# EasyEDA Pro project ADA4530_2025-03-15.epro, schematic Schematic1
Board Name: ADC; Create Date: 2024-12-08; Page Name: P1; Project Name: yuhuiceshi; Schematic Name: Schematic1; Update Date: 2025-02-16; Company: 嘉立创EDA; Page Size: A4; Version: V1.0
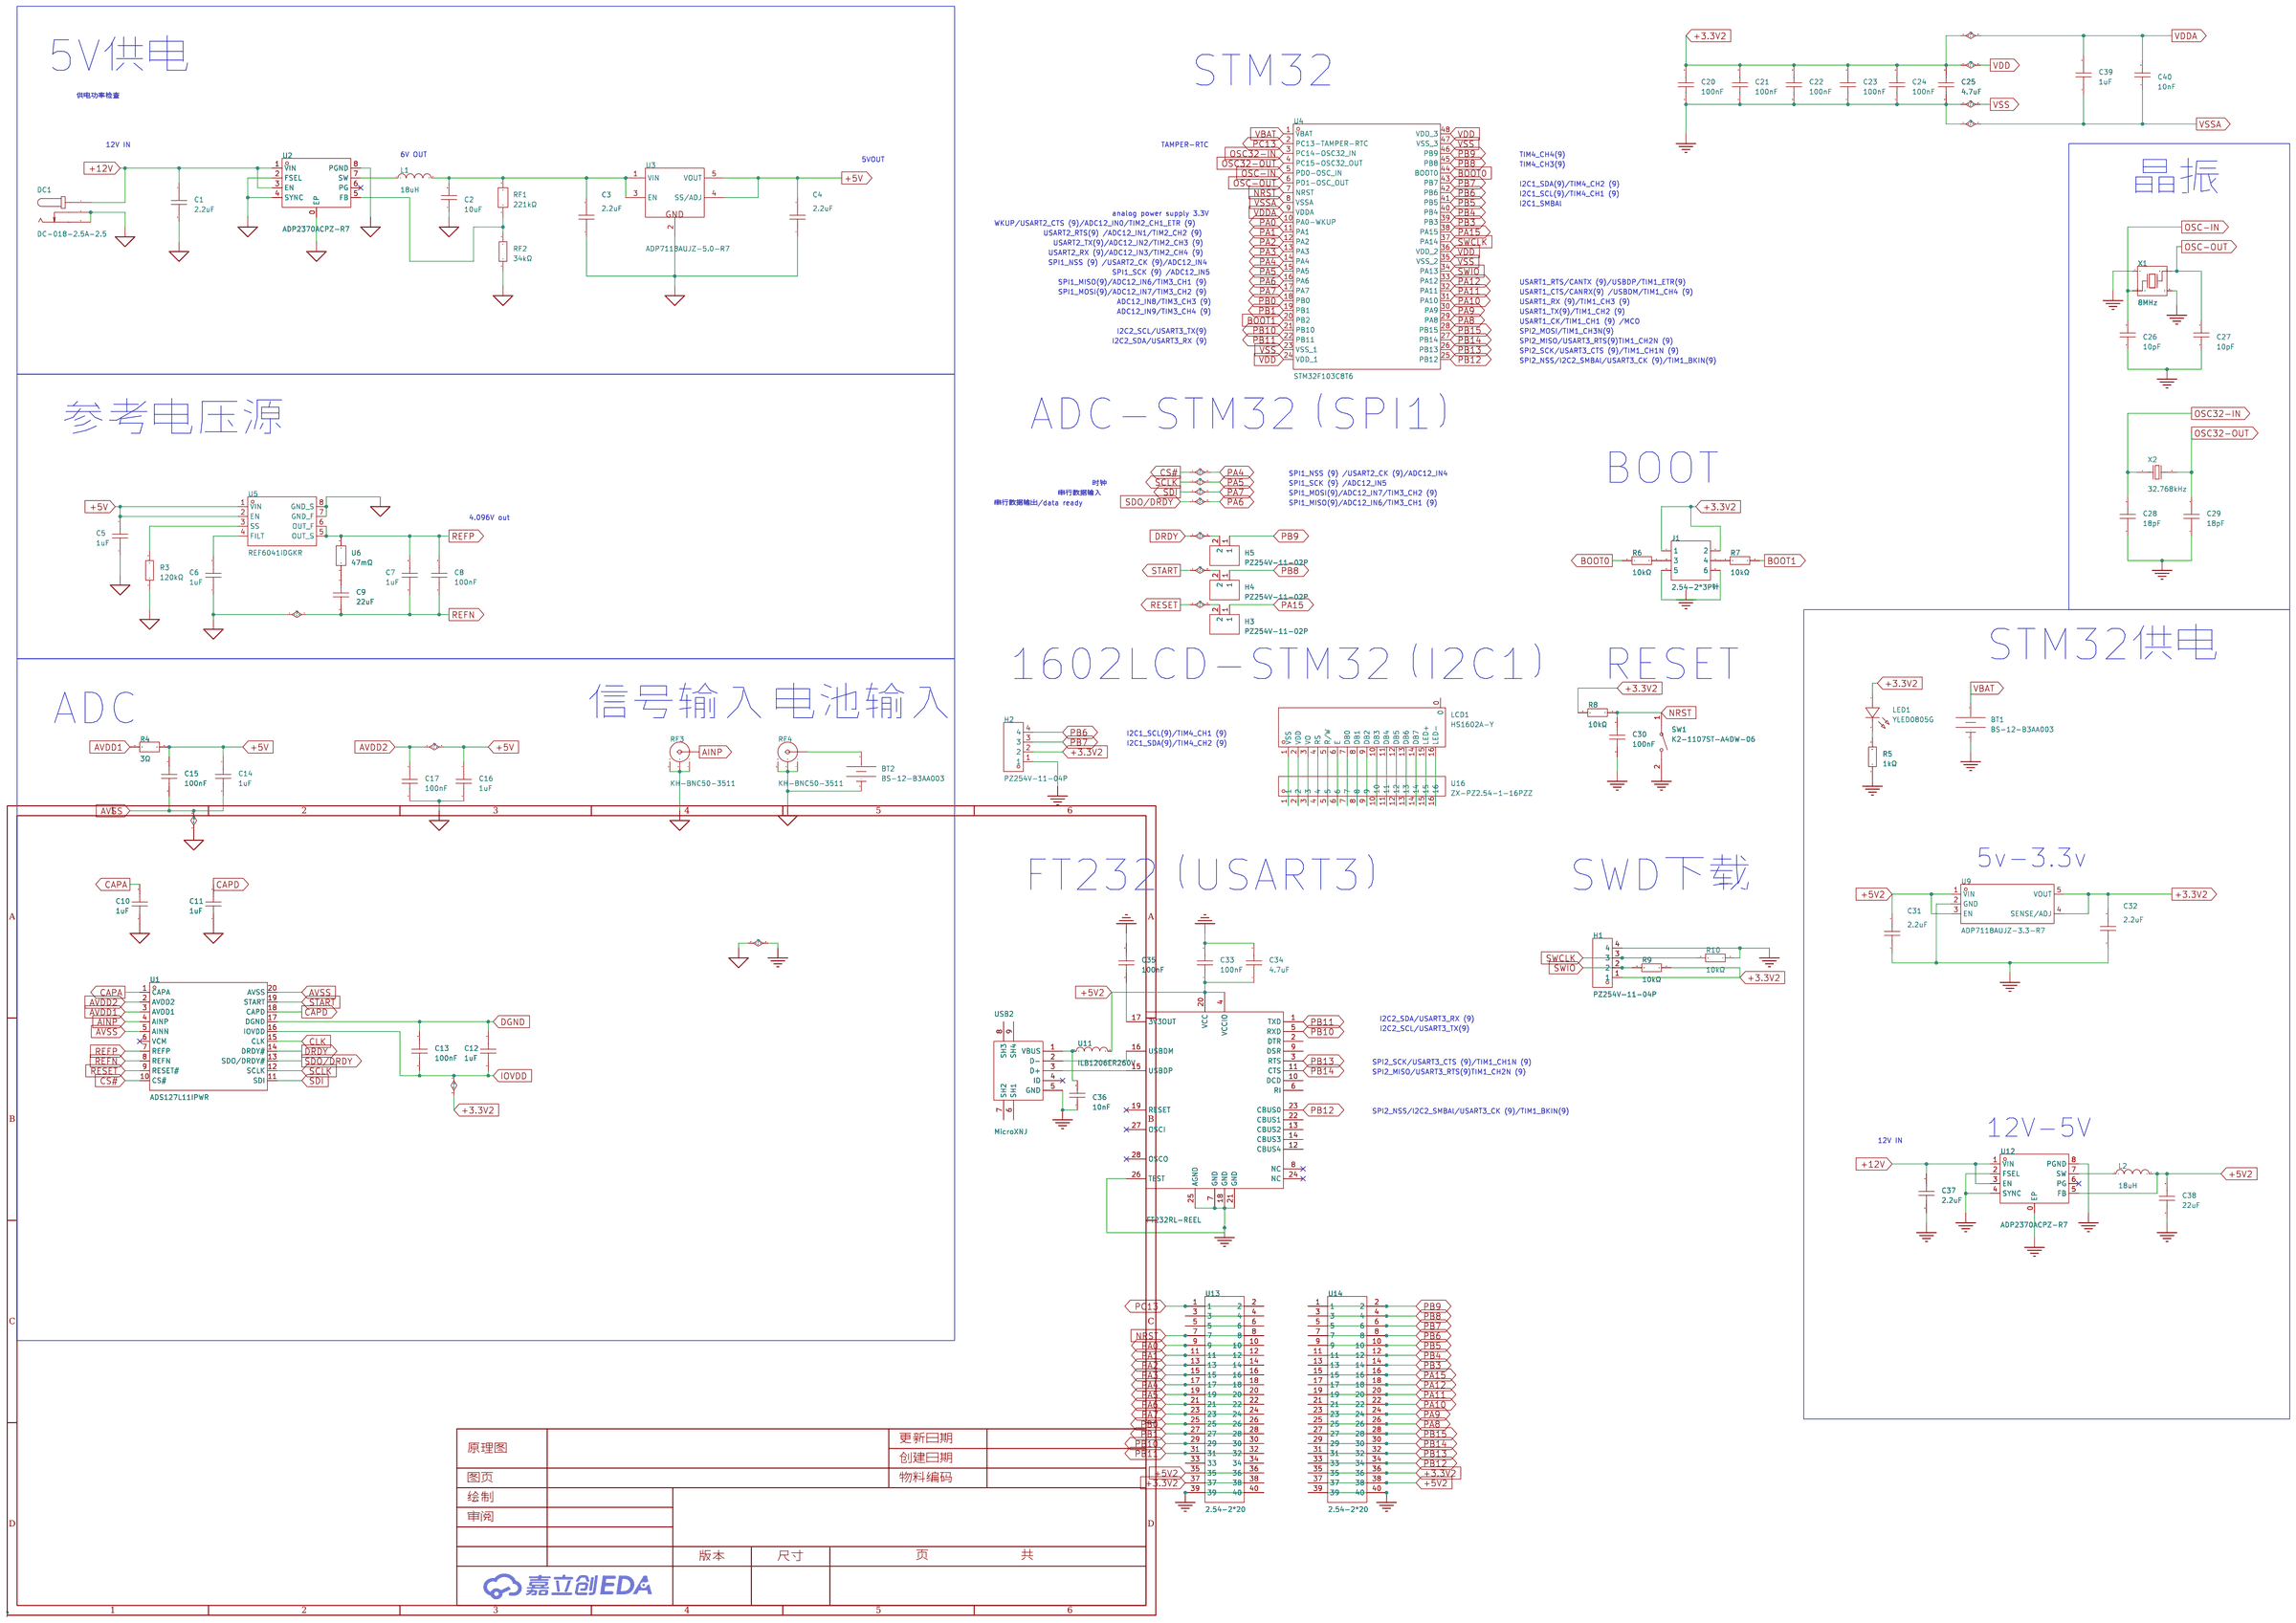
[diagram p2: schematic sheet]

## Parts
BT1  BS-12-B3AA003  [BAT-SMD_BS-12-B3AA011]
BT2  BS-12-B3AA003  [BAT-SMD_BS-12-B3AA011]
C1  2.2uF  [C0805]
C2  10uF  [C1206]
C3  2.2uF  [C0805]
C4  2.2uF  [C0805]
C5  1uF  [C0603]
C6  1uF  [C0603]
C7  1uF  [C0603]
C8  100nF  [C0402]
C9  22uF  [C1210]
C10  1uF  [C0603]
C11  1uF  [C0603]
C12  1uF  [C0603]
C13  100nF  [C0402]
C14  1uF  [C0603]
C15  100nF  [C0402]
C16  1uF  [C0603]
C17  100nF  [C0402]
C20  100nF  [C0402]
C21  100nF  [C0402]
C22  100nF  [C0402]
C23  100nF  [C0402]
C24  100nF  [C0402]
C25  4.7uF  [C0402]
C26  10pF  [C0603]
C27  10pF  [C0603]
C28  18pF  [C0603]
C29  18pF  [C0603]
C30  100nF  [C0402]
C31  2.2uF  [C0805]
C32  2.2uF  [C0805]
C33  100nF  [C0402]
C34  4.7uF  [C0402]
C35  100nF  [C0402]
C36  10nF  [C0603]
C37  2.2uF  [C0805]
C38  22uF  [C0603]
C39  1uF  [C0603]
C40  10nF  [C0603]
DC1  DC-018-2.5A-2.5  [DC-IN-TH_DC-018]
H1  PZ254V-11-04P  [HDR-TH_4P-P2.54-V-M]
H2  PZ254V-11-04P  [HDR-TH_4P-P2.54-V-M]
H3  PZ254V-11-02P  [HDR-TH_2P-P2.54-V-M]
H4  PZ254V-11-02P  [HDR-TH_2P-P2.54-V-M]
H5  PZ254V-11-02P  [HDR-TH_2P-P2.54-V-M]
J1  2.54-2*3P针  [HDR-TH_6P-P2.54-V-M-R2-C3-S2.54-1]
L1  18uH  [IND-SMD_L12.7-W12.7]
L2  18uH  [IND-SMD_L12.7-W12.7]
LCD1  HS1602A-Y  [LCD1602]
LED1  YLED0805G  [LED0805-FD]
R3  120kΩ  [R0603]
R4  3Ω  [R0402]
R5  1kΩ  [R0805]
R6  10kΩ  [R0805]
R7  10kΩ  [R0805]
R8  10kΩ  [R0805]
R9  10kΩ  [R0805]
R10  10kΩ  [R0805]
RF1  221kΩ  [R0603]
RF2  34kΩ  [R0603]
RF3  KH-BNC50-3511  [ANT-TH_KH-BNC50-3511]
RF4  KH-BNC50-3511  [ANT-TH_KH-BNC50-3511]
SW1  K2-1107ST-A4DW-06  [KEY-SMD_L6.2-W3.6-LS8.0]
U1  ADS127L11IPWR  [TSSOP-20_L6.5-W4.4-P0.65-LS6.4-BL]
U2  ADP2370ACPZ-R7  [LFCSP-8_L3.0-W3.0-P0.50-BL-EP_ADP2370ACPZ-R7]
U3  ADP7118AUJZ-5.0-R7  [SOT-23-5_L3.0-W1.7-P0.95-LS2.8-BR]
U4  STM32F103C8T6  [LQFP-48_L7.0-W7.0-P0.50-LS9.0-BL]
U5  REF6041IDGKR  [VSSOP-8_L3.0-W3.0-P0.65-LS4.9-BL]
U6  47mΩ  [R1210]
U9  ADP7118AUJZ-3.3-R7  [TSOT-23-5_L2.9-W1.6-P0.95-LS2.8-BR]
U10  FT232RL-REEL  [SSOP-28_L10.2-W5.3-P0.65-LS7.8-BL]
U11  ILB1206ER260V  [L1206]
U12  ADP2370ACPZ-R7  [LFCSP-8_L3.0-W3.0-P0.50-BL-EP_ADP2370ACPZ-R7]
U13  2.54-2*20  [HDR-TH_40P-P2.54-V-F-R2-C20-S2.54]
U14  2.54-2*20  [HDR-TH_40P-P2.54-V-F-R2-C20-S2.54]
U16  ZX-PZ2.54-1-16PZZ  [HDR-TH_16P-P2.54-V-M-2]
USB2  MicroXNJ  [MICRO-USB-SMD_MICROXNJ]
X1  8MHz  [CRYSTAL-SMD_4P-L3.2-W2.5-BL]
X2  32.768kHz  [FC-135R_L3.2-W1.5]

## Library data of the parts
BT1 BT2 = BS-12-B3AA003: 连接器类型:电池底座;适用电池规格:CR1220;触头材质:磷青铜;工作温度范围:-25℃~+85℃;; LCSC Part Name: 电池底座 适用电池:CR1220; Supplier Part: C964723; Manufacturer: MYOUNG(美阳); Supplier Footprint: SMD; JLCPCB Part Class: 扩展库; Datasheet: https://atta.szlcsc.com/upload/public/pdf/source/20201218/C964723_733B638E287393F86295A2A4DAE43C75.pdf; Supplier: LCSC; Connector Type: 电池底座; Battery Type: CR1220; Contact Material: 磷青铜; Operating Temperature Range: -25℃~+85℃
C1 C3 C4 C31 C32 C37 = CL21A225KBQNNNE: 容值:2.2uF;精度:±10%;额定电压:50V;材质(温度系数):X5R;; LCSC Part Name: 2.2uF ±10% 50V; Supplier Part: C377773; Manufacturer: SAMSUNG(三星); Supplier Footprint: 0805; JLCPCB Part Class: 基础库; Datasheet: https://atta.szlcsc.com/upload/public/pdf/source/20160218/1457707763339.pdf; Supplier: LCSC; Tolerance: ±10%; Voltage Rated: 50V; Temperature Coefficient: X5R
C2 = CL31A106KAHNNNE: 容值:10uF;精度:±10%;额定电压:25V;材质(温度系数):X5R;; LCSC Part Name: 10uF ±10% 25V; Supplier Part: C9807; Manufacturer: SAMSUNG(三星); Supplier Footprint: 1206; JLCPCB Part Class: 扩展库; Datasheet: https://atta.szlcsc.com/upload/public/pdf/source/20160218/1457707763339.pdf; Supplier: LCSC; Tolerance: ±10%; Voltage Rated: 25V; Temperature Coefficient: X5R
C5-C7 C10-C12 C14 C16 C39 = CL10A105KB8NNNC: 容值:1uF;精度:±10%;额定电压:50V;材质(温度系数):X5R;; LCSC Part Name: 1uF ±10% 50V; Supplier Part: C15849; Manufacturer: SAMSUNG(三星); Supplier Footprint: 0603; JLCPCB Part Class: 基础库; Datasheet: https://atta.szlcsc.com/upload/public/pdf/source/20160218/1457707763339.pdf; Supplier: LCSC; Tolerance: ±10%; Voltage Rated: 50V; Temperature Coefficient: X5R
C8 C13 C15 C17 C20-C24 C30 C33 C35 = GRM155R71A104KA01D: 容值:100nF;精度:±10%;额定电压:10V;材质(温度系数):X7R;; LCSC Part Name: 100nF ±10% 10V; Supplier Part: C71687; Manufacturer: muRata(村田); Supplier Footprint: 0402; JLCPCB Part Class: 扩展库; Datasheet: https://atta.szlcsc.com/upload/public/pdf/source/20180228/C71687_15198055953951377607.pdf; Supplier: LCSC; Tolerance: ±10%; Voltage Rated: 10V; Temperature Coefficient: X7R
C9 = CL32B226KAJNNNE: 容值:22uF;精度:±10%;额定电压:25V;材质(温度系数):X7R;; LCSC Part Name: 22uF ±10% 25V; Supplier Part: C309062; Manufacturer: SAMSUNG(三星); Supplier Footprint: 1210; JLCPCB Part Class: 扩展库; Datasheet: https://atta.szlcsc.com/upload/public/pdf/source/20160218/1457707763339.pdf; Supplier: LCSC; Tolerance: ±10%; Voltage Rated: 25V; Temperature Coefficient: X7R
C25 C34 = CL05A475KP5NRNC: 容值:4.7uF;精度:±10%;额定电压:10V;材质(温度系数):X5R;; LCSC Part Name: 4.7uF ±10% 10V; Supplier Part: C368809; Manufacturer: SAMSUNG(三星); Supplier Footprint: 0402; JLCPCB Part Class: 扩展库; Datasheet: https://atta.szlcsc.com/upload/public/pdf/source/20160218/1457707763339.pdf; Supplier: LCSC; Tolerance: ±10%; Voltage Rated: 10V; Temperature Coefficient: X5R
C26 C27 = CL10C100JB8NNNC: 容值:10pF;精度:±5%;额定电压:50V;材质(温度系数):C0G;; LCSC Part Name: 10pF ±5% 50V; Supplier Part: C1634; Manufacturer: SAMSUNG(三星); Supplier Footprint: 0603; JLCPCB Part Class: 基础库; Datasheet: https://atta.szlcsc.com/upload/public/pdf/source/20160218/1457707763339.pdf; Supplier: LCSC; Tolerance: ±5%; Voltage Rated: 50V; Temperature Coefficient: C0G
C28 C29 = FCC0603N180J500CT: 容值:18pF;精度:±5%;额定电压:50V;材质(温度系数):C0G;; LCSC Part Name: 18pF ±5% 50V; Supplier Part: C5137620; Manufacturer: FOJAN(富捷); Supplier Footprint: 0603; JLCPCB Part Class: 扩展库; Datasheet: https://atta.szlcsc.com/upload/public/pdf/source/20220818/0EB3B7FB2F5648AC16609637FBA7DABE.pdf; Supplier: LCSC; Tolerance: ±5%; Voltage Rated: 50V; Temperature Coefficient: C0G
C36 C40 = CC0603KRX7R9BB103: 容值:10nF;精度:±10%;额定电压:50V;材质(温度系数):X7R;; LCSC Part Name: 10nF ±10% 50V; Supplier Part: C100042; Manufacturer: YAGEO(国巨); Supplier Footprint: 0603; JLCPCB Part Class: 扩展库; Datasheet: https://atta.szlcsc.com/upload/public/pdf/source/20181008/C309510_22F155564471FAF6A489F7D68F34234E.pdf; Supplier: LCSC; Tolerance: ±10%; Voltage Rated: 50V; Temperature Coefficient: X7R
C38 = GRM188R60J226MEA0D: 容值:22uF;精度:±20%;额定电压:6.3V;材质(温度系数):X5R;; LCSC Part Name: 22uF ±20% 6.3V; Supplier Part: C77042; Manufacturer: muRata(村田); Supplier Footprint: 0603; JLCPCB Part Class: 扩展库; Datasheet: https://atta.szlcsc.com/upload/public/pdf/source/20200305/C490387_23319AE8C154DEB24C505E6C82A8106A.pdf; Supplier: LCSC; Tolerance: ±20%; Voltage Rated: 6.3V; Temperature Coefficient: X5R
DC1 = DC-018-2.5A-2.5: 连接器类型:DC电源插座;安装方式:直插;触点内径:2.5mm;触点外径:5.5mm;额定电流:2.5A;额定电压:24V;工作温度范围:-20℃~+70℃;; LCSC Part Name: DC电源插座 内径:2.5mm 外径:5.5mm; Supplier Part: C2880553; Manufacturer: XKB Connection(中国星坤); Supplier Footprint: 插件; JLCPCB Part Class: 扩展库; Datasheet: https://atta.szlcsc.com/upload/public/pdf/source/20211011/841513E81FE39239E013AD10F679532A.pdf; Supplier: LCSC; Connector Type: DC电源插座; Mounting Style: 直插; Inside Contact Diameter: 2.5mm; Outside Contact Diameter: 5.5mm; Current Rating (Max): 2.5A; Voltage Rating (Max): 24V; Operating Temperature Range: -20℃~+70℃
H1 H2 = PZ254V-11-04P: 插针结构:1x4P;间距:2.54mm;行距:-;圆针/方针:方针;安装类型:直插;排数:单排;总PIN位数:4P;额定电流:3A;额定电压:250V;配合针长度:6mm;塑高:2.5mm;端接针长度:3mm;触头材质:-;工作温度范围:-40℃~+105℃;颜色:黑色;; LCSC Part Name: 间距:2.54mm 1x4P 直插 方针; Supplier Part: C2691448; Manufacturer: XFCN(兴飞); Supplier Footprint: 插件,P=2.54mm; JLCPCB Part Class: 扩展库; Datasheet: https://atta.szlcsc.com/upload/public/pdf/source/20200309/C492403_F9F19131791D08044AD4F84F8E751A34.pdf; Supplier: LCSC; Pin Structure: 1x4P; Pitch: 2.54mm; Circluar Pins/Square Pins: 方针; Mounting Type: 直插; Number of Rows: 单排; Number of Pins: 4P; Current Rating (Max): 3A; Voltage Rating (Max): 250V; Length of Mating Pin: 6mm; Insulation Height: 2.5mm; Length of End Connection Pin: 3mm; Operating Temperature Range: -40℃~+105℃; Color: 黑色
H3-H5 = PZ254V-11-02P: 插针结构:1x2P;间距:2.54mm;行距:-;圆针/方针:方针;安装类型:直插;排数:单排;总PIN位数:2P;额定电流:-;额定电压:-;配合针长度:6mm;塑高:2.5mm;端接针长度:3mm;触头材质:黄铜;触头镀层:-;工作温度范围:-40℃~+105℃;颜色:黑色;; LCSC Part Name: 间距:2.54mm 1x2P 直插 方针; Supplier Part: C492401; Manufacturer: XFCN(兴飞); Supplier Footprint: 插件,P=2.54mm; JLCPCB Part Class: 扩展库; Datasheet: https://atta.szlcsc.com/upload/public/pdf/source/20200309/C492401_A812433581A9B211A7FFA413ADDFF0E5.pdf; Supplier: LCSC; Pin Structure: 1x2P; Pitch: 2.54mm; Circluar Pins/Square Pins: 方针; Mounting Type: 直插; Number of Rows: 单排; Number of Pins: 2P; Length of Mating Pin: 6mm; Insulation Height: 2.5mm; Length of End Connection Pin: 3mm; Contact Material: 黄铜; Operating Temperature Range: -40℃~+105℃; Color: 黑色
J1 = 2.54-2*3P针: 插针结构:-;间距:2.54mm;行距:-;圆针/方针:-;安装类型:直插;排数:双排;总PIN位数:6P;额定电流:-;额定电压:-;配合针长度:-;塑高:-;触头材质:-;触头镀层:-;颜色:黑色;; LCSC Part Name: 间距:2.54mm 直插; Supplier Part: C65114; Manufacturer: BOOMELE(博穆精密); Supplier Footprint: 插件,P=2.54mm; JLCPCB Part Class: 扩展库; Supplier: LCSC; Pitch: 2.54mm; Mounting Type: 直插; Number of Rows: 双排; Number of Pins: 6P; Color: 黑色
L1 L2 = SRR1208-180ML: 电感值:18uH;精度:±20%;额定电流:3.8A;饱和电流(Isat):4A;类型:-;; LCSC Part Name: 18uH ±20% 4A; Supplier Part: C1331002; Manufacturer: BOURNS; Supplier Footprint: SMD,12.7x12.7mm; JLCPCB Part Class: 扩展库; Datasheet: https://atta.szlcsc.com/upload/public/pdf/source/20210611/27EB3296191C192B2696E5AAF504BCA4.pdf; Supplier: LCSC; Tolerance: ±20%; Rated Current: 3.8A; Saturation Current (Isat): 4A; DC Resistance (DCR): 40mΩ
LCD1 = HS1602A-Y: 主控芯片:SPLC780;尺寸(inch):2;; LCSC Part Name: 2寸16x2字符型8位通讯单色LCD液晶显示模组黄绿屏; Supplier Part: C18198250; Manufacturer: HS(汉昇); JLCPCB Part Class: 扩展库; Datasheet: https://atta.szlcsc.com/upload/public/pdf/source/20230921/41ABF4C08C578F5401713169C9FD3309.pdf; Supplier: LCSC; Main Control Chip: SPLC780; Size: 2; Operating Temperature: -20℃~+70℃
LED1 = YLED0805G: 翠绿; LCSC Part Name: 发光管; Supplier Part: C25170728; Manufacturer: YONGYUTAI(永裕泰); Supplier Footprint: 0805; JLCPCB Part Class: 扩展库; Datasheet: https://atta.szlcsc.com/upload/public/pdf/source/20240703/FE33100110A935C7236A3399DDEE41BC.pdf; Supplier: LCSC
R3 = 0603WAF1203T5E: 电阻类型:厚膜电阻;阻值:120kΩ;精度:±1%;功率:100mW;最大工作电压:75V;温度系数:±100ppm/℃;; LCSC Part Name: 120kΩ ±1% 100mW 厚膜电阻; Supplier Part: C25808; Manufacturer: UNI-ROYAL(厚声); Supplier Footprint: 0603; JLCPCB Part Class: 基础库; Datasheet: https://atta.szlcsc.com/upload/public/pdf/source/20200306/C422600_1E6D84923E4A46A82E41ADD87F860B5C.pdf; Supplier: LCSC; Type: 厚膜电阻; Tolerance: ±1%; Power(Watts): 100mW; Overload Voltage (Max): 75V; Temperature Coefficient: ±100ppm/℃; Operating Temperature Range: -55℃~+155℃
R4 = FRC0402F3R00TS: 电阻类型:厚膜电阻;阻值:3Ω;精度:±1%;功率:62.5mW;最大工作电压:50V;温度系数:±200ppm/℃;; LCSC Part Name: 3Ω ±1% 62.5mW 厚膜电阻; Supplier Part: C2933093; Manufacturer: FOJAN(富捷); Supplier Footprint: 0402; JLCPCB Part Class: 扩展库; Datasheet: https://atta.szlcsc.com/upload/public/pdf/source/20211221/925EC7D7225764EE0046F22065062C87.pdf; Supplier: LCSC; Type: 厚膜电阻; Tolerance: ±1%; Power(Watts): 62.5mW; Overload Voltage (Max): 50V; Temperature Coefficient: ±200ppm/℃; Operating Temperature Range: -55℃~+155℃
R5 = AR05BTDW1001: 电阻类型:薄膜电阻;阻值:1kΩ;精度:±0.1%;功率:125mW;最大工作电压:100V;温度系数:±50ppm/℃;; LCSC Part Name: 薄膜电阻 1kΩ ±0.1% 125mW; Supplier Part: C319815; Manufacturer: Viking(光颉); Supplier Footprint: 0805; JLCPCB Part Class: Extended Part; Datasheet: https://atta.szlcsc.com/upload/public/pdf/source/20191129/C465721_10D49275DB41E427863CE9C8D788770A.pdf; Supplier: LCSC; Type: 薄膜电阻; Tolerance: ±0.1%; Power(Watts): 125mW; Overload Voltage (Max): 100V; Temperature Coefficient: ±50ppm/℃; Operating Temperature Range: -55℃~+155℃
R6-R10 = 0805W8F1002T5E_C17414: 电阻类型:厚膜电阻;阻值:10kΩ;精度:±1%;功率:125mW;最大工作电压:150V;温度系数:±100ppm/℃;; LCSC Part Name: 10kΩ ±1% 125mW 厚膜电阻; Supplier Part: C17414; Manufacturer: UNI-ROYAL(厚声); Manufacturer Part: 0805W8F1002T5E; Supplier Footprint: 0805; JLCPCB Part Class: 基础库; Datasheet: https://atta.szlcsc.com/upload/public/pdf/source/20200306/C422600_1E6D84923E4A46A82E41ADD87F860B5C.pdf; Supplier: LCSC; Type: 厚膜电阻; Tolerance: ±1%; Power(Watts): 125mW; Overload Voltage (Max): 150V; Temperature Coefficient: ±100ppm/℃; Operating Temperature Range: -55℃~+155℃
RF1 = FRC0603F2213TS: 电阻类型:厚膜电阻;阻值:221kΩ;精度:±1%;功率:100mW;温度系数:±100ppm/℃;; LCSC Part Name: 厚膜电阻 221kΩ ±1% 100mW; Supplier Part: C7467463; Manufacturer: FOJAN(富捷); Supplier Footprint: 0603; JLCPCB Part Class: 扩展库; Datasheet: https://atta.szlcsc.com/upload/public/pdf/source/20211221/9022FBEBBD509006A57EBC43C1F2F40C.pdf; Supplier: LCSC; Type: 厚膜电阻; Tolerance: ±1%; Power(Watts): 100mW; Temperature Coefficient: ±100ppm/℃
RF2 = 0603WAF3402T5E: 电阻类型:厚膜电阻;阻值:34kΩ;精度:±1%;功率:100mW;最大工作电压:75V;温度系数:±100ppm/℃;; LCSC Part Name: 34kΩ ±1% 100mW 厚膜电阻; Supplier Part: C23008; Manufacturer: UNI-ROYAL(厚声); Supplier Footprint: 0603; JLCPCB Part Class: 扩展库; Datasheet: https://atta.szlcsc.com/upload/public/pdf/source/20200306/C422600_1E6D84923E4A46A82E41ADD87F860B5C.pdf; Supplier: LCSC; Type: 厚膜电阻; Tolerance: ±1%; Power(Watts): 100mW; Overload Voltage (Max): 75V; Temperature Coefficient: ±100ppm/℃; Operating Temperature Range: -55℃~+155℃
RF3 RF4 = KH-BNC50-3511: 连接器类型:板端;接口类型:内孔;端口数量:1;接口直径:9.5mm;接口长度/高度:-;频率-最大值:3GHz;射频系列:BNC;阻抗:50Ω;样式:弯头;工作温度范围:-55℃~+155℃;; LCSC Part Name: BNC 内孔 弯头; Supplier Part: C2837587; Manufacturer: kinghelm(金航标); Supplier Footprint: 插件; JLCPCB Part Class: 扩展库; Datasheet: https://atta.szlcsc.com/upload/public/pdf/source/20221123/AFF24A942BB0EF6B7776F494013BE75C.pdf; Supplier: LCSC; Connector Type: 板端; Interface Type: 内孔; Number of Ports: 1; Interface Diameter: 9.5mm; Frequency-Max: 3GHz; RF Series: BNC; Impedance: 50Ω; Style: 弯头; Operating Temperature Range: -55℃~+155℃
SW1 = K2-1107ST-A4DW-06: 电路结构:单刀单掷;按钮形状:矩形按钮;作用力:250gf;安装方式:立贴;开关长度:6.1mm;开关宽度:3.6mm;开关高度:2.5mm;触点电流:50mA;额定电压(DC):12V;绝缘电阻:100MΩ;带灯:-;机械寿命:10万次;; LCSC Part Name: 轻触开关 3.6*6.1*2.5; Supplier Part: C118141; Manufacturer: 韩国韩荣; Supplier Footprint: SMD; JLCPCB Part Class: 扩展库; Datasheet: https://atta.szlcsc.com/upload/public/pdf/source/20210810/381712CEF248770C072B585C3485C888.pdf; Supplier: LCSC; Circuit: 单刀单掷; Actuator Style: 矩形按钮; Operating Force: 250gf; Mounting Style: 立贴; Switch Length: 6.1mm; Switch Width: 3.6mm; Switch Height: 2.5mm; Contact Current: 50mA; Voltage Rating (DC): 12V; Insulation Resistance: 100MΩ; Mechanical Life: 10万次; Operating Temperature: -25℃~+85℃
U1 = ADS127L11IPWR: 接口:串行；SPI;电源电压:2.85V~5.5V;采样率:400kHz;分辨率:24;; LCSC Part Name: 具有易驱动输入和宽带或低延迟滤波器的 24 位 400kSPS ADC; Supplier Part: C5215155; Manufacturer: TI(德州仪器); Supplier Footprint: TSSOP-20-175mil; JLCPCB Part Class: 扩展库; Datasheet: https://www.ti.com/cn/lit/gpn/ads127l11; Supplier: LCSC; Interface: 串行；SPI; differential input: 是; number of channels: 1; Supply Voltage: 2.85V~5.5V; sampling frequency: 400kHz; resolution: 24; Operating Temperature: -45℃~+125℃
U2 U12 = ADP2370ACPZ-R7: 功能类型:降压型;输出类型:可调;工作电压:3.2V~15V;输出电压:-;输出电流:800mA;; LCSC Part Name: 800mA、低静态电流降压调节器; Supplier Part: C481882; Manufacturer: ADI(亚德诺); Supplier Footprint: LFCSP-8-WD(3x3); JLCPCB Part Class: 扩展库; Datasheet: https://atta.szlcsc.com/upload/public/pdf/source/20200113/C481882_3242BD049A7F7733653B76B10E6A9D8D.pdf; Supplier: LCSC; Function: 降压型; Output Type: 可调; Input Voltage: 3.2V~15V; Output Current: 800mA; Operating Temperature: -40℃~+125℃; Number of Outputs: 1; Topology: 降压式; Switch tube (built-in/external): 内置
U3 = ADP7118AUJZ-5.0-R7: 输出类型:固定;最大输入电压:20V;输出电压:5V;最大输出电流:200mA;输出极性:正极;; Supplier Part: C141943; Manufacturer: ADI(亚德诺); Supplier Footprint: TSOT-23-5; JLCPCB Part Class: 扩展库; Datasheet: https://atta.szlcsc.com/upload/public/pdf/source/20180628/C194022_239F12D87A493F0A2DF0E3CFBC8CAC3D.pdf; Supplier: LCSC; Output Type: 固定; Maximum Input Voltage: 20V; Output Voltage: 5V; MAX Output Current: 200mA; Dropout Voltage: 420mV@(200mA); standby current: 140uA; Operating Temperature: -40℃~+125℃@(Ta); Output Polarity: 正极; Number of Outputs: 1
U4 = STM32F103C8T6: CPU内核:ARM-M3;CPU最大主频:72MHz;应用领域:-;; LCSC Part Name: 主流增强型ARM Cortex-M3 MCU，具有64 KB Flash、72 MHz CPU、电机控制、USB和CAN; Supplier Part: C8734; Manufacturer: ST(意法半导体); Supplier Footprint: LQFP-48(7x7); JLCPCB Part Class: 扩展库; Datasheet: https://atta.szlcsc.com/upload/public/pdf/source/20220812/8363ACEC51AD55ECEB84799464F7CB85.pdf; Supplier: LCSC; CPU Core: ARM-M3; CPU Maximum Speed: 72MHz; Program Storage Size: 64KB; Program Memory Type: FLASH; Number of I/O: 37; ADC (Bit): 12bit; Low Voltage Detection Threshold: 2V~3.6V
U5 = REF6041IDGKR: 输出类型:固定;输入电压:4.35V~5.5V;输出电流:4mA;精度:±0.05%;; Supplier Part: C2157051; Manufacturer: TI(德州仪器); Supplier Footprint: VSSOP-8-0.65mm; JLCPCB Part Class: 扩展库; Datasheet: https://www.ti.com/cn/lit/gpn/ref6033; Supplier: LCSC; Output Type: 固定; Input Voltage: 4.35V~5.5V; Output Current: 4mA; Tolerance: ±0.05%; Temperature Coefficient: 5ppm/℃; Reference Type: 串联; Supply Current: 1.1mA; Noise - 1/10Hz to 10Hz: 3uVp-p; Operating Temperature: -40℃~+125℃@(Ta)
U6 = RL1210FR-070R047L: 电阻类型:厚膜电阻;阻值:47mΩ;精度:±1%;功率:500mW;温度系数:±1000ppm/℃;; LCSC Part Name: 厚膜电阻 47mΩ ±1% 500mW; Supplier Part: C728531; Manufacturer: YAGEO(国巨); Supplier Footprint: 1210; JLCPCB Part Class: 扩展库; Datasheet: https://atta.szlcsc.com/upload/public/pdf/source/20200831/C728531_EE5B3688874933D6C39DA60DA0663108.pdf; Supplier: LCSC; Type: 厚膜电阻; Tolerance: ±1%; Power(Watts): 500mW; Temperature Coefficient: ±1000ppm/℃; Operating Temperature Range: -55℃~+155℃
U9 = ADP7118AUJZ-3.3-R7: 输出类型:固定;最大输入电压:20V;输出电压:3.3V;最大输出电流:200mA;电源纹波抑制比(PSRR):88dB;输出极性:正极;; LCSC Part Name: 输入20V 输出3.3V 200mA; Supplier Part: C194022; Manufacturer: ADI(亚德诺); Supplier Footprint: TSOT-23-5; JLCPCB Part Class: 扩展库; Datasheet: https://atta.szlcsc.com/upload/public/pdf/source/20180628/C194022_239F12D87A493F0A2DF0E3CFBC8CAC3D.pdf; Supplier: LCSC; Output Type: 固定; Maximum Input Voltage: 20V; Output Voltage: 3.3V; MAX Output Current: 200mA; Power Supply Rejection Ratio (PSRR): 88dB; Dropout Voltage: 420mV@(200mA); standby current: 140uA; Operating Temperature: -40℃~+125℃@(Ta); Output Polarity: 正极; Number of Outputs: 1
U10 = FT232RL-REEL: 应用功能:USB转UART;接口协议:-;; LCSC Part Name: FT232R USB UART 芯片; Supplier Part: C8690; Manufacturer: FTDI(飞特帝亚); Supplier Footprint: SSOP-28-208mil; JLCPCB Part Class: 扩展库; Datasheet: https://atta.szlcsc.com/upload/public/pdf/source/20130221/1457706592200.pdf; Supplier: LCSC; Applications Function: USB转UART; Supply Voltage: 3.3V~5.25V; Operating Temperature: -40℃~+85℃
U11 = ILB1206ER260V: 标称阻抗@测试频率:26Ω@100MHz;直流电阻(RDC):50mΩ;; Supplier Part: C2999377; Manufacturer: VISHAY(威世); Supplier Footprint: 1206; JLCPCB Part Class: 扩展库; Datasheet: https://atta.szlcsc.com/upload/public/pdf/source/20220429/A7FF318AFF1E23934AC6E57BABB68AC1.pdf; Supplier: LCSC; Impedance @ Frequency: 26Ω@100MHz; DC Resistance: 50mΩ; Circuits: 1
U13 U14 = 2.54-2*20: 插孔结构:2x20P;间距:2.54mm;行距:2.54mm;圆孔/方孔:方孔;安装类型:直插;排数:双排;总孔位数:40P;额定电流:2.5A;额定电压:-;插孔方向:顶部;塑高:8.5mm;工作温度范围:-40℃~+105℃;; LCSC Part Name: 间距:2.54mm 2x20P 直插; Supplier Part: C2977589; Manufacturer: ZHOURI(洲日); Supplier Footprint: 插件,P=2.54mm; JLCPCB Part Class: 扩展库; Datasheet: https://atta.szlcsc.com/upload/public/pdf/source/20220328/834E302BE3C038BBC5C70F5E02589B1E.pdf; Supplier: LCSC; Holes Structure: 2x20P; Pitch: 2.54mm; Row Spacing: 2.54mm; Circular Hole / Square Hole: 方孔; Mounting Type: 直插; Number of Rows: 双排; Number of Holes: 40P; Current Rating (Max): 2.5A; Holes Direction: 顶部; Insulation Height: 8.5mm; Operating Temperature Range: -40℃~+105℃
U16 = ZX-PZ2.54-1-16PZZ: 插针结构:1x16P;间距:2.54mm;行距:-;圆针/方针:方针;安装类型:直插;排数:单排;总PIN位数:16P;额定电流:3A;额定电压:1kV;配合针长度:6mm;塑高:2.5mm;端接针长度:3mm;触头材质:黄铜;触头镀层:金;工作温度范围:-40℃~+105℃;焊接温度(最大值):-;颜色:黑色;; LCSC Part Name: 1x16P 间距:2.54mm 方针 直插; Supplier Part: C7501270; Manufacturer: Megastar(兆星); Supplier Footprint: 插件,P=2.54mm; JLCPCB Part Class: 扩展库; Datasheet: https://atta.szlcsc.com/upload/public/pdf/source/20231122/E454B24BEC0C004E7BA34E686CD1994E.pdf; Supplier: LCSC; Pin Structure: 1x16P; Pitch: 2.54mm; Circluar Pins/Square Pins: 方针; Mounting Type: 直插; Number of Rows: 单排; Number of Pins: 16P; Current Rating (Max): 3A; Voltage Rating (Max): 1kV; Length of Mating Pin: 6mm; Insulation Height: 2.5mm; Length of End Connection Pin: 3mm; Contact Material: 黄铜; Contact Plating: 金; Operating Temperature Range: -40℃~+105℃; Color: 黑色
USB2 = MicroXNJ: 连接器类型:Micro-B;标准:USB 2.0;公母:母;安装方式:卧贴;触点数量:5P;端口数量:1;额定电流 - 电源:1.8A;工作温度范围:-20℃~+85℃;; LCSC Part Name: Micro-B 母 卧贴; Supplier Part: C404969; Manufacturer: SHOU HAN(首韩); Supplier Footprint: SMD; JLCPCB Part Class: 扩展库; Datasheet: https://atta.szlcsc.com/upload/public/pdf/source/20220415/2494EDFF499AF6F852F7C820374B6AF3.pdf; Supplier: LCSC; Connector Type: Micro-B; Standard: USB 2.0; Gender: 母; Mounting Style: 卧贴; Number of Contacts: 5P; Number of Ports: 1; Current Rating - Power (Max): 1.8A; Operating Temperature Range: -20℃~+85℃; Rated Voltage (Max): 30V; Connect-Disconnect Life: 5千次; Core Colour: 黑色
X1 = TAXM8M4RDBCCT2T: 晶振类型:贴片晶振;频率:8MHz;常温频差:±10ppm;负载电容:10pF;频率稳定度(全温):±15ppm;; LCSC Part Name: 8MHz ±10ppm 10pF; Supplier Part: C400090; Manufacturer: YJX(雅晶鑫); Supplier Footprint: SMD3225-4P; JLCPCB Part Class: 扩展库; Datasheet: https://atta.szlcsc.com/upload/public/pdf/source/20190626/C400090_CF95B89E745AFE4EF2E392EF8AC009D6.pdf; Supplier: LCSC; Crystal Type: 贴片晶振; Normal temperature Frequency Tolerance: ±10ppm; Load Capacitor: 10pF; Frequency Stability(Full temperature range): ±15ppm; Equivalent Series Resistance (ESR): 250Ω; Operating Temperature: -40℃~+85℃
X2 = Q13FC13500004_C32346: 晶振类型:贴片晶振;频率:32.768kHz;常温频差:±20ppm;负载电容:12.5pF;; LCSC Part Name: 32.768kHz ±20ppm 12.5pF; Supplier Part: C32346; Manufacturer: EPSON(爱普生); Manufacturer Part: Q13FC13500004; Supplier Footprint: SMD3215-2P; JLCPCB Part Class: 基础库; Datasheet: https://atta.szlcsc.com/upload/public/pdf/source/20240418/0E0FF5F0356BA3753F616001439D1416.pdf; Supplier: LCSC; Crystal Type: 贴片晶振; Normal temperature Frequency Tolerance: ±20ppm; Load Capacitor: 12.5pF; Equivalent Series Resistance (ESR): 70kΩ; Operating Temperature: -40℃~+85℃

## Nets
+3.3V2: C12.1 C13.1 C20.2 C21.2 C22.2 C23.2 C24.2 C25.2 C32.2 C39.2 C40.2 H1.1 H2.2 J1.1 J1.2 LED1.1(A) R8.2 R9.1 U1.16(IOVDD) U4.9(VDDA) U4.24(VDD_1) U4.36(VDD_2) U4.48(VDD_3) U9.4(SENSE/ADJ) U9.5(VOUT) U13.37 U13.38 U14.35 U14.36
+5V: C4.2 C5.2 C14.1 C15.1 C16.1 C17.1 R4.2 U1.2(AVDD2) U3.4(SS/ADJ) U3.5(VOUT) U5.1(VIN) U5.2(EN)
+5V2: C31.2 C33.1 C34.1 C38.2 L2.2 U9.1(VIN) U9.3(EN) U10.4(VCCIO) U10.20(VCC) U11.2 U12.5(FB) U13.35 U13.36 U14.37 U14.38
+12V: C1.1 C37.1 DC1.1 U2.1(VIN) U2.3(EN) U12.1(VIN) U12.3(EN)
AGND: BT1.2(-) BT2.2(-) C1.2 C2.1 C3.1 C4.1 C5.1 C6.1 C7.1 C8.1 C9.2 C10.1 C11.1 C14.2 C15.2 C16.2 C17.2 C20.1 C21.1 C22.1 C23.1 C24.1 C25.1 C26.1 C27.1 C28.1 C29.1 C30.1 C31.1 C32.1 C33.2 C34.2 C35.2 C36.1 C37.2 C38.1 C39.1 C40.1 DC1.2 DC1.3 H1.4 H2.1 J1.5 J1.6 R3.1 R5.1 R10.1 RF2.1 RF3.2 RF3.3 RF3.4 RF4.2 RF4.3 RF4.4 SW1.2 U1.5(AINN) U1.8(REFN) U1.20(AVSS) U2.0(EP) U2.2(FSEL) U2.4(SYNC) U2.8(PGND) U3.2(GND) U4.8(VSSA) U4.23(VSS_1) U4.35(VSS_2) U4.47(VSS_3) U5.7(GND_F) U5.8(GND_S) U9.2(GND) U10.7(GND) U10.18(GND) U10.21(GND) U10.25(AGND) U10.26(TEST) U12.0(EP) U12.2(FSEL) U12.4(SYNC) U12.8(PGND) U13.39 U13.40 U14.39 U14.40 USB2.5(GND) X1.2 X1.4
AVDD1: R4.1 U1.3(AVDD1)
DGND: C12.2 C13.2 U1.17(DGND)
VBAT: BT1.1(+) U4.1(VBAT)
AINP: RF3.1(OUT) U1.4(AINP)
BOOT0: R6.1 U4.44(BOOT0)
BOOT1: R7.2 U4.20(PB2)
CAPA: C10.2 U1.1(CAPA)
CAPD: C11.2 U1.18(CAPD)
CLK: U1.15(CLK)
CS#: U1.10(CS#) U4.14(PA4) U13.17 U13.18
DRDY: H5.2 U1.14(DRDY#)
NRST: C30.2 R8.1 SW1.1 U4.7(NRST) U13.7 U13.8
OSC32-IN: C28.2 U4.3(PC14-OSC32_IN) X2.1
OSC32-OUT: C29.2 U4.4(PC15-OSC32_OUT) X2.2
OSC-IN: C26.2 U4.5(PD0-OSC_IN) X1.1
OSC-OUT: C27.2 U4.6(PD1-OSC_OUT) X1.3
PA0: U4.10(PA0-WKUP) U13.9 U13.10
PA1: U4.11(PA1) U13.11 U13.12
PA2: U4.12(PA2) U13.13 U13.14
PA3: U4.13(PA3) U13.15 U13.16
PA5: U1.12(SCLK) U4.15(PA5) U13.19 U13.20
PA6: U1.13(SDO/DRDY#) U4.16(PA6) U13.21 U13.22
PA7: U1.11(SDI) U4.17(PA7) U13.23 U13.24
PA8: U4.29(PA8) U14.25 U14.26
PA9: U4.30(PA9) U14.23 U14.24
PA10: U4.31(PA10) U14.21 U14.22
PA11: U4.32(PA11) U14.19 U14.20
PA12: U4.33(PA12) U14.17 U14.18
PA15: H3.1 U4.38(PA15) U14.15 U14.16
PB0: U4.18(PB0) U13.25 U13.26
PB1: U4.19(PB1) U13.27 U13.28
PB3: U4.39(PB3) U14.13 U14.14
PB4: U4.40(PB4) U14.11 U14.12
PB5: U4.41(PB5) U14.9 U14.10
PB6: H2.4 U4.42(PB6) U14.7 U14.8
PB7: H2.3 U4.43(PB7) U14.5 U14.6
PB8: H4.1 U4.45(PB8) U14.3 U14.4
PB9: H5.1 U4.46(PB9) U14.1 U14.2
PB10: U4.21(PB10) U10.5(RXD) U13.29 U13.30
PB11: U4.22(PB11) U10.1(TXD) U13.31 U13.32
PB12: U4.25(PB12) U10.23(CBUS0) U14.33 U14.34
PB13: U4.26(PB13) U10.3(RTS) U14.31 U14.32
PB14: U4.27(PB14) U10.11(CTS) U14.29 U14.30
PB15: U4.28(PB15) U14.27 U14.28
PC13: U4.2(PC13-TAMPER-RTC) U13.1 U13.2
REFP: C7.2 C8.2 U1.7(REFP) U5.5(OUT_S) U5.6(OUT_F) U6.2
RESET: H3.2 U1.9(RESET#)
START: H4.2 U1.19(START)
SWCLK: H1.3 R10.2 U4.37(PA14)
SWIO: H1.2 R9.2 U4.34(PA13)
$1N9515: C2.2 C3.2 L1.2 RF1.2 U3.1(VIN) U3.3(EN)
$1N9516: L1.1 U2.7(SW)
$1N9520: RF1.1 RF2.2 U2.5(FB)
$1N10642: R3.2 U5.3(SS)
$1N10736: C6.2 U5.4(FILT)
$1N13390: LED1.2(K) R5.2
$1N15546: J1.3 R6.2
$1N17400: J1.4 R7.1
$1N19382: BT2.1(+) RF4.1(OUT)
$1N21170: C35.1 U10.17(3V3OUT)
$1N21195: U10.15(USBDP) USB2.3(D+)
$1N21199: U10.16(USBDM) USB2.2(D-)
$1N21362: C36.2 U11.1 USB2.1(VBUS)
$1N22122: L2.1 U12.7(SW)
$1N23716: U13.5 U13.6
$1N23719: U13.3 U13.4
$1N25080: LCD1.2(VDD) U16.2
$1N25084: LCD1.3(VO) U16.3
$1N25089: LCD1.4(RS) U16.4
$1N25094: LCD1.5(R/W) U16.5
$1N25099: LCD1.6(E) U16.6
$1N25104: LCD1.7(DB0) U16.7
$1N25109: LCD1.8(DB1) U16.8
$1N25114: LCD1.9(DB2) U16.9
$1N25119: LCD1.10(DB3) U16.10
$1N25132: LCD1.11(DB4) U16.11
$1N25136: LCD1.12(DB5) U16.12
$1N25141: LCD1.13(DB6) U16.13
$1N25146: LCD1.14(DB7) U16.14
$1N25151: LCD1.15(LED+) U16.15
$1N25156: LCD1.16(LED-) U16.16
$1N25161: LCD1.1(VSS) U16.1
$1N25600: C9.1 U6.1

Not connected (* = marked no-connect by the designer): LCD1 0; U1 6(VCM)*; U2 6(PG)*; U10 2(DTR) 6(RI) 8(NC)* 9(DSR) 10(DCD) 12(CBUS4) 13(CBUS2) 14(CBUS3) 19(RESET)* 22(CBUS1) 24(NC)* 27(OSCI)* 28(OSCO)*; U12 6(PG)*; U13 33 34; USB2 4(ID)* 6(SH1) 7(SH2) 8(SH3) 9(SH4)

## Notes on the sheet
- 5V供电
- STM32
- 供电功率检查
- 12V IN
- TAMPER-RTC
- 6V OUT
- TIM4_CH4(9)
- 5VOUT
- TIM4_CH3(9)
- I2C1_SDA(9)/TIM4_CH2 (9)
- I2C1_SCL(9)/TIM4_CH1 (9)
- I2C1_SMBAl
- 晶振
- analog power supply 3.3V
- WKUP/USART2_CTS (9)/ADC12_IN0/TIM2_CH1_ETR (9)
- USART2_RTS(9) /ADC12_IN1/TIM2_CH2 (9)
- USART2_TX(9)/ADC12_IN2/TIM2_CH3 (9)
- SPI1_NSS (9) /USART2_CK (9)/ADC12_IN4
- USART2_RX (9)/ADC12_IN3/TIM2_CH4 (9)
- SPI1_SCK (9) /ADC12_IN5
- SPI1_MISO(9)/ADC12_IN6/TIM3_CH1 (9)
- USART1_RTS/CANTX (9)/USBDP/TIM1_ETR(9)
- SPI1_MOSI(9)/ADC12_IN7/TIM3_CH2 (9)
- USART1_CTS/CANRX(9) /USBDM/TIM1_CH4 (9)
- ADC12_IN8/TIM3_CH3 (9)
- USART1_RX (9)/TIM1_CH3 (9)
- ADC12_IN9/TIM3_CH4 (9)
- USART1_TX(9)/TIM1_CH2 (9)
- I2C2_SCL/USART3_TX(9)
- SPI2_MOSI/TIM1_CH3N(9)
- USART1_CK/TIM1_CH1 (9) /MCO
- I2C2_SDA/USART3_RX (9)
- SPI2_MISO/USART3_RTS(9)TIM1_CH2N (9)
- SPI2_SCK/USART3_CTS (9)/TIM1_CH1N (9)
- SPI2_NSS/I2C2_SMBAl/USART3_CK (9)/TIM1_BKIN(9)
- 参考电压源
- ADC-STM32（SPI1）
- 时钟
- SPI1_NSS (9) /USART2_CK (9)/ADC12_IN4
- SPI1_SCK (9) /ADC12_IN5
- BOOT
- 串行数据输入
- SPI1_MOSI(9)/ADC12_IN7/TIM3_CH2 (9)
- 串行数据输出/data ready
- SPI1_MISO(9)/ADC12_IN6/TIM3_CH1 (9)
- 4.096V out
- STM32供电
- 1602LCD-STM32（I2C1）
- RESET
- ADC
- 信号输入
- 电池输入
- I2C1_SCL(9)/TIM4_CH1 (9)
- I2C1_SDA(9)/TIM4_CH2 (9)
- 5v-3.3v
- FT232（USART3）
- SWD下载
- I2C2_SDA/USART3_RX (9)
- I2C2_SCL/USART3_TX(9)
- SPI2_SCK/USART3_CTS (9)/TIM1_CH1N (9)
- SPI2_MISO/USART3_RTS(9)TIM1_CH2N (9)
- SPI2_NSS/I2C2_SMBAl/USART3_CK (9)/TIM1_BKIN(9)
- 12V IN
- 12V-5V
